# Altium schematic sheet sm.SchDoc
size A3
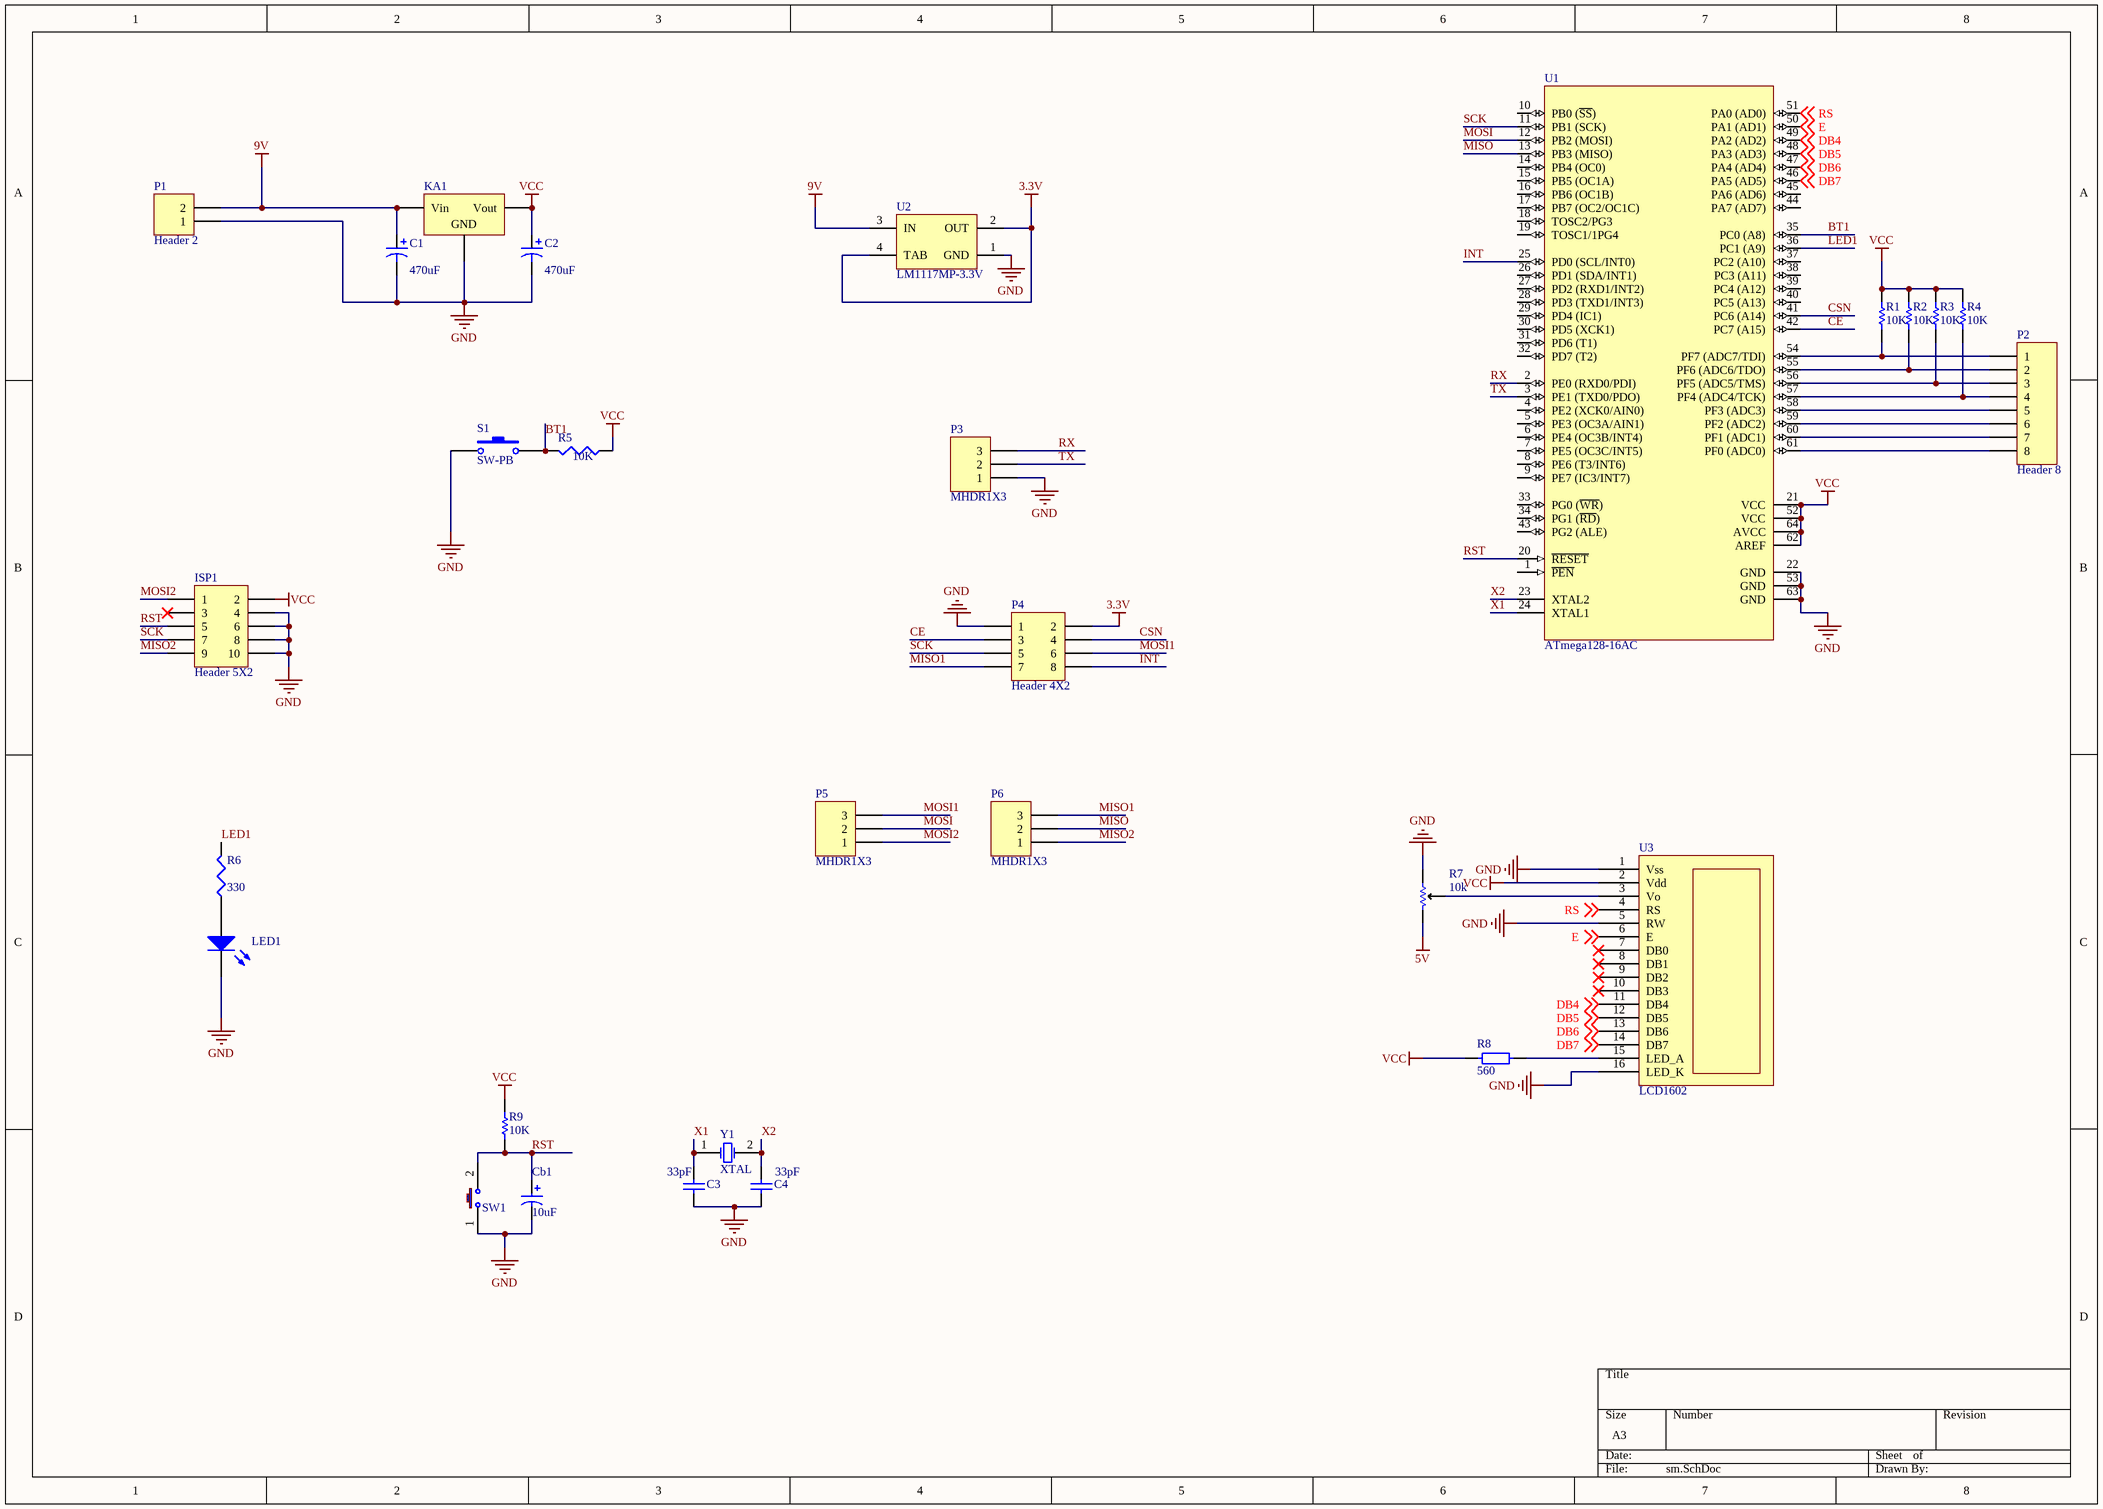
[diagram p0: sm.SchDoc]

## Parts
C1  value 470uF  [CAPPR5-5x5]  (hidden comment: Cap Pol1)
C2  value 470uF  [CAPPR5-5x5]  (hidden comment: Cap Pol1)
C3  value 33pF  [SM/C_0805]  (hidden comment: Cap)
C4  value 33pF  [SM/C_0805]  (hidden comment: Cap)
Cb1  10uF  [SM/C_0805]
ISP1  Header 5X2  [HDR2X5]
KA1  Volt Reg  [TO-220]  (value not drawn)
LED1  LED3  [DSO-C2/D5.6]  (value not drawn)
P1  Header 2  [HDR1X2]
P2  Header 8  [HDR1X8]
P3  MHDR1X3  [MHDR1X3]
P4  Header 4X2  [HDR2X4]
P5  MHDR1X3  [MHDR1X3]
P6  MHDR1X3  [MHDR1X3]
R1  10K  [SM/C_0805]
R2  10K  [SM/C_0805]
R3  10K  [SM/C_0805]
R4  10K  [SM/C_0805]
R5  value 10K  [RESC1608L]  (hidden comment: Res3)
R6  value 330  [RESC1608L]  (hidden comment: Res3)
R7  10k  [BienTro]
R8  560  [SM/C_0805]
R9  10K  [SM/C_0805]
S1  SW-PB  [SPST-2]
SW1  BUTTON 2 PIN  [KEYSMALL2]  (value not drawn)
U1  ATmega128-16AC  [64A_N]
U2  LM1117MP-3.3V  [SM/SOT223_1234]
U3  LCD1602  [LCD1602]
Y1  XTAL  [CAPR5.08-7.8x3.2]

## Nets
3.3V: P4.2 U2.2(OUT) U2.4(TAB)
5V: R7.2
9V: C1.1 KA1.1(Vin) P1.2 U2.3(IN)
GND: C1.2 C2.2 C3.1 C4.1 Cb1.2 ISP1.4 ISP1.6 ISP1.8 ISP1.10 KA1.2(GND) LED1.2(K) P1.1 P3.1 P4.1 R7.0 S1.1 SW1.1 U1.22(GND) U1.53(GND) U1.63(GND) U2.1(GND) U3.1(Vss) U3.5(RW) U3.16(LED_K)
VCC: C2.1 ISP1.2 KA1.3(Vout) R1.2 R2.2 R3.2 R4.2 R5.1 R8.1 R9.2 U1.21(VCC) U1.52(VCC) U1.62(AREF) U1.64(AVCC) U3.2(Vdd)
BT1: R5.2 S1.2 U1.35(PC0_(A8))
CE: P4.3 U1.42(PC7_(A15))
CSN: P4.4 U1.41(PC6_(A14))
DB4: U1.49(PA2_(AD2)) U3.11(DB4) ; off-sheet DB4
DB5: U1.48(PA3_(AD3)) U3.12(DB5) ; off-sheet DB5
DB6: U1.47(PA4_(AD4)) U3.13(DB6) ; off-sheet DB6
DB7: U1.46(PA5_(AD5)) U3.14(DB7) ; off-sheet DB7
E: U1.50(PA1_(AD1)) U3.6(E) ; off-sheet E
INT: P4.8 U1.25(PD0_(SCL/INT0))
LED1: R6.2 U1.36(PC1_(A9))
MISO: P6.2 U1.13(PB3_(MISO))
MISO1: P4.7 P6.3
MISO2: ISP1.9 P6.1
MOSI: P5.2 U1.12(PB2_(MOSI))
MOSI1: P4.6 P5.3
MOSI2: ISP1.1 P5.1
RS: U1.51(PA0_(AD0)) U3.4(RS) ; off-sheet RS
RST: Cb1.1 ISP1.5 R9.1 SW1.2 U1.20(~{RESET})
RX: P3.3 U1.2(PE0_(RXD0/PDI))
SCK: ISP1.7 P4.5 U1.11(PB1_(SCK))
TX: P3.2 U1.3(PE1_(TXD0/PDO))
X1: C3.2 U1.24(XTAL1) Y1.1(OSC1)
X2: C4.2 U1.23(XTAL2) Y1.2(OSC2)
NetLED1_1: LED1.1(A) R6.1
NetP2_1: P2.1 R1.1 U1.54(PF7_(ADC7/TDI))
NetP2_2: P2.2 R2.1 U1.55(PF6_(ADC6/TDO))
NetP2_3: P2.3 R3.1 U1.56(PF5_(ADC5/TMS))
NetP2_4: P2.4 R4.1 U1.57(PF4_(ADC4/TCK))
NetP2_5: P2.5 U1.58(PF3_(ADC3))
NetP2_6: P2.6 U1.59(PF2_(ADC2))
NetP2_7: P2.7 U1.60(PF1_(ADC1))
NetP2_8: P2.8 U1.61(PF0_(ADC0))
NetR7_1: R7.1 U3.3(Vo)
NetR8_2: R8.2 U3.15(LED_A)

Not connected (* = marked no-connect by the designer): ISP1 3*; U1 1(~{PEN}) 4(PE2_(XCK0/AIN0)) 5(PE3_(OC3A/AIN1)) 6(PE4_(OC3B/INT4)) 7(PE5_(OC3C/INT5)) 8(PE6_(T3/INT6)) 9(PE7_(IC3/INT7)) 10(PB0_(~{SS})) 14(PB4_(OC0)) 15(PB5_(OC1A)) 16(PB6_(OC1B)) 17(PB7_(OC2/OC1C)) 18(TOSC2/PG3) 19(TOSC1/1PG4) 26(PD1_(SDA/INT1)) 27(PD2_(RXD1/INT2)) 28(PD3_(TXD1/INT3)) 29(PD4_(IC1)) 30(PD5_(XCK1)) 31(PD6_(T1)) 32(PD7_(T2)) 33(PG0_(~{WR})) 34(PG1_(~{RD})) 37(PC2_(A10)) 38(PC3_(A11)) 39(PC4_(A12)) 40(PC5_(A13)) 43(PG2_(ALE)) 44(PA7_(AD7)) 45(PA6_(AD6)); U3 7(DB0)* 8(DB1)* 9(DB2)* 10(DB3)*

## Library data of the parts
C1 C2 = Cap Pol1: Polarized Capacitor (Radial); Published: 8-Jun-2000; LatestRevisionDate: 17-Jul-2002; LatestRevisionNote: Re-released for DXP Platform.; PackageReference: RB7.6-15; Publisher: Altium Limited
C3 C4 = Cap: Capacitor; Published: 8-Jun-2000; LatestRevisionDate: 17-Jul-2002; LatestRevisionNote: Re-released for DXP Platform.; PackageReference: RAD-0.3; Publisher: Altium Limited
Cb1 = CAP POL 250
ISP1 = Header 5X2: Header, 5-Pin, Dual row; LatestRevisionDate: 17-Jul-2002; LatestRevisionNote: Re-released for DXP Platform.; Publisher: Altium Limited
KA1 = Volt Reg: Voltage Regulator; Published: 24-Mar-1999; LatestRevisionDate: 29-May-2009; LatestRevisionNote: IPC-7351 Footprint Added.; PackageReference: D2PAK; Publisher: Altium Limited; PackageDescription: 3-Pin Transistor Outline Package 2.54 mm Pitch, 15.1 mm Lead Span
LED1 = LED3: Typical BLUE SiC LED; Published: 8-Jun-2000; LatestRevisionDate: 17-Dec-2003; LatestRevisionNote: PCB Footprint replaced.; DatasheetVersion: 16-Apr-2002; PackageVersion: 16-Apr-2002; PackageReference: 3.5X2.8X1.9; Publisher: Altium Limited
P1 = Header 2: Header, 2-Pin; LatestRevisionDate: 17-Jul-2002; LatestRevisionNote: Re-released for DXP Platform.; Publisher: Altium Limited
P2 = Header 8: Header, 8-Pin; LatestRevisionDate: 17-Jul-2002; LatestRevisionNote: Re-released for DXP Platform.; Publisher: Altium Limited
P3 P5 P6 = MHDR1X3: Header, 3-Pin; LatestRevisionDate: 17-Jul-2002; LatestRevisionNote: Re-released for DXP Platform.; Publisher: Altium Limited
P4 = Header 4X2: Header, 4-Pin, Dual row; LatestRevisionDate: 17-Jul-2002; LatestRevisionNote: Re-released for DXP Platform.; Publisher: Altium Limited
R1-R4 R9 = R 300
R5 R6 = Res3: Resistor; Published: 8-Jun-2000; LatestRevisionDate: 29-May-2009; LatestRevisionNote: IPC-7351 Footprint Added.; PackageReference: J1-0603; Publisher: Altium Limited; PackageDescription: Chip Resistor
R7 = BienTro
R8 = Resistor
S1 = SW-PB: Switch; Published: 24-Mar-1999; LatestRevisionDate: 17-Jul-2002; LatestRevisionNote: Re-released for DXP Platform.; PackageReference: SPST-2; Publisher: Altium Limited
U1 = ATmega128-16AC: 8-Bit AVR Microcontroller with 128K Bytes of In-System Programmable Flash Memory; Published: 17-Sep-2003; LatestRevisionDate: 13-Apr-2006; LatestRevisionNote: IPC-7351 Footprint Added.; DatasheetVersion: 2467G-AVR-09/02; PackageVersion: revB, Oct-2001; PackageReference: 64A; Publisher: Altium Limited; PackageDescription: 64-Pin Thin Quad Flat Pack 0.8 mm Pitch; Code_JEDEC: MS-026-AEB; ComponentLink1Description: Manufacturer Link; ComponentLink1URL: http://www.atmel.com; ComponentLink2Description: Datasheet; ComponentLink2URL: http://www.atmel.com/dyn/resources/prod_documents/doc2467.pdf
U2 = LM1117MP-3.3: 800mA Low-Dropout Linear Regulator; Manufacturer: National Semiconductor; CompType: LDO IC; PackageTopMarking: XYTT*N05A; Published: 27-Nov-2008; DatasheetVersion: Apr-2006; PackageVersion: revB, Apr-2003; PackageReference: MP04A; Publisher: Altium Limited; PackageDescription: Molded SOT-223, 6.50 x 3.56 x 1.6mm Body, 4 Lead, 2.3mm Pitch; PartNumber: LM1117MP-3.3; RoHS: O; PinCount: 4; DigiKeyPartNumber: LM1117MP-3.3CT-ND; Code_JEDEC: TO-261-AA; Code_IPC: SOT223-4; ComponentLink1Description: LM1117 Datasheet; ComponentLink1URL: http://www.national.com/ds/LM/LM1117.pdf; ComponentLink2Description: LM1117 Web Page; ComponentLink2URL: http://www.national.com/pf/LM/LM1117.html; ComponentLink3Description: MP04A Package Page; ComponentLink3URL: http://www.national.com/packaging/folders/mp04a.html
Y1 = XTAL: Crystal Oscillator; Published: 8-Jun-2000; LatestRevisionDate: 17-Jul-2002; LatestRevisionNote: Re-released for DXP Platform.; PackageReference: R38; Publisher: Altium Limited